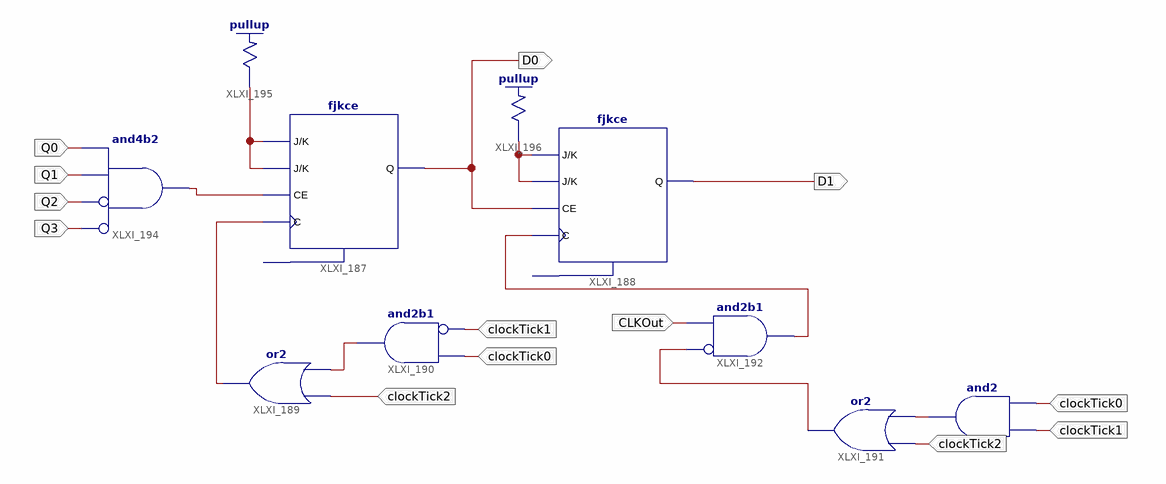
[diagram p0: schematic sheet 1]
// Xilinx ISE schematic lab9_exp3_YOGI.sch (spartan3e) as structural Verilog: 10 symbols, 10 ports
module lab9_exp3_YOGI (
  input  CLKOut,
  input  Q1,
  input  Q3,
  input  Q2,
  input  Q0,
  input  clockTick2,
  input  clockTick0,
  input  clockTick1,
  output D1,
  output D0
);

  wire XLXN_679, XLXN_680, XLXN_684, XLXN_685, XLXN_686, XLXN_691, XLXN_699, XLXN_700;

  fjkce XLXI_187 (.C(XLXN_680), .CE(XLXN_691), .J(XLXN_699), .K(XLXN_699), .Q(D0));  // open: CLR
  fjkce XLXI_188 (.C(XLXN_686), .CE(D0), .J(XLXN_700), .K(XLXN_700), .Q(D1));  // open: CLR
  or XLXI_189 (XLXN_680, XLXN_679, clockTick2);
  and XLXI_190 (XLXN_679, ~clockTick1, clockTick0);  // and2b1
  or XLXI_191 (XLXN_684, XLXN_685, clockTick2);
  and XLXI_192 (XLXN_686, ~XLXN_684, CLKOut);  // and2b1
  and XLXI_193 (XLXN_685, clockTick0, clockTick1);
  and XLXI_194 (XLXN_691, ~Q3, ~Q2, Q1, Q0);  // and4b2
  \pullup  XLXI_195 (.O(XLXN_699));
  \pullup  XLXI_196 (.O(XLXN_700));
endmodule
